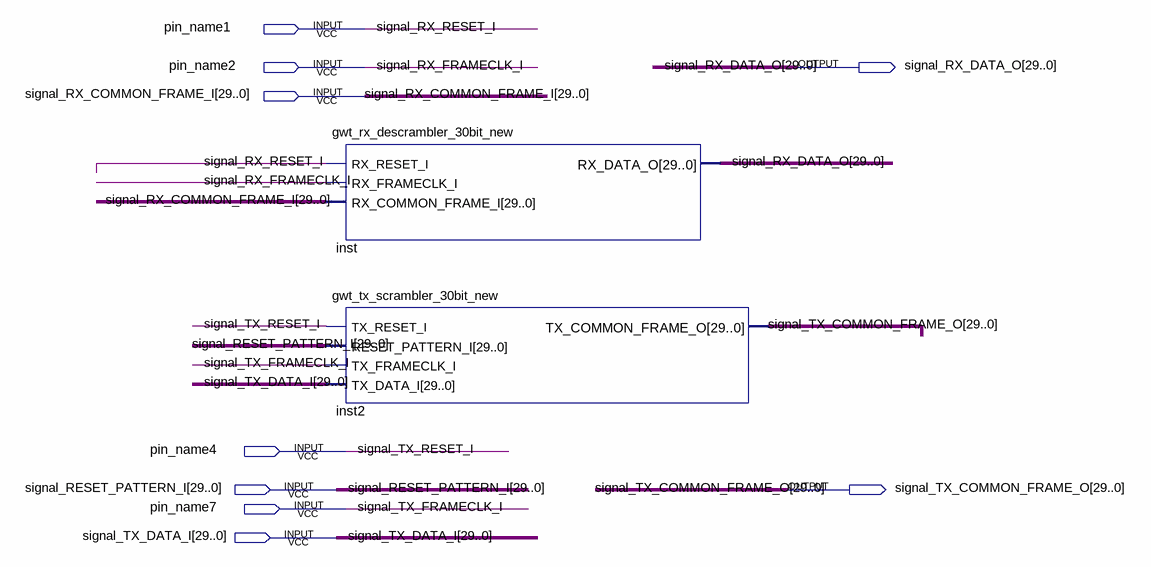
[diagram p0: schematic sheet]
// Quartus schematic Scrambler.bdf as structural Verilog: 2 symbols, 9 pins
module Scrambler (
  input  pin_name1,
  input  pin_name2,
  input  [29:0] signal_RX_COMMON_FRAME_I,
  input  pin_name4,
  input  [29:0] signal_RESET_PATTERN_I,
  input  pin_name7,
  input  [29:0] signal_TX_DATA_I,
  output [29:0] signal_RX_DATA_O,
  output [29:0] signal_TX_COMMON_FRAME_O
);

  gwt_rx_descrambler_30bit_new inst (
    .RX_RESET_I(pin_name1), .RX_FRAMECLK_I(pin_name2), .RX_COMMON_FRAME_I(signal_RX_COMMON_FRAME_I),
    .RX_DATA_O(signal_RX_DATA_O));
  gwt_tx_scrambler_30bit_new inst2 (
    .TX_RESET_I(pin_name4), .RESET_PATTERN_I(signal_RESET_PATTERN_I), .TX_FRAMECLK_I(pin_name7),
    .TX_DATA_I(signal_TX_DATA_I), .TX_COMMON_FRAME_O(signal_TX_COMMON_FRAME_O));

  // Other names for the same wires on the sheet: signal_RX_FRAMECLK_I = pin_name2; signal_RX_RESET_I = pin_name1;
  //   signal_TX_FRAMECLK_I = pin_name7; signal_TX_RESET_I = pin_name4
endmodule
